# Altium schematic sheet ADCS.SchDoc
size A4; SheetNumber: 5; SheetTotal: 5
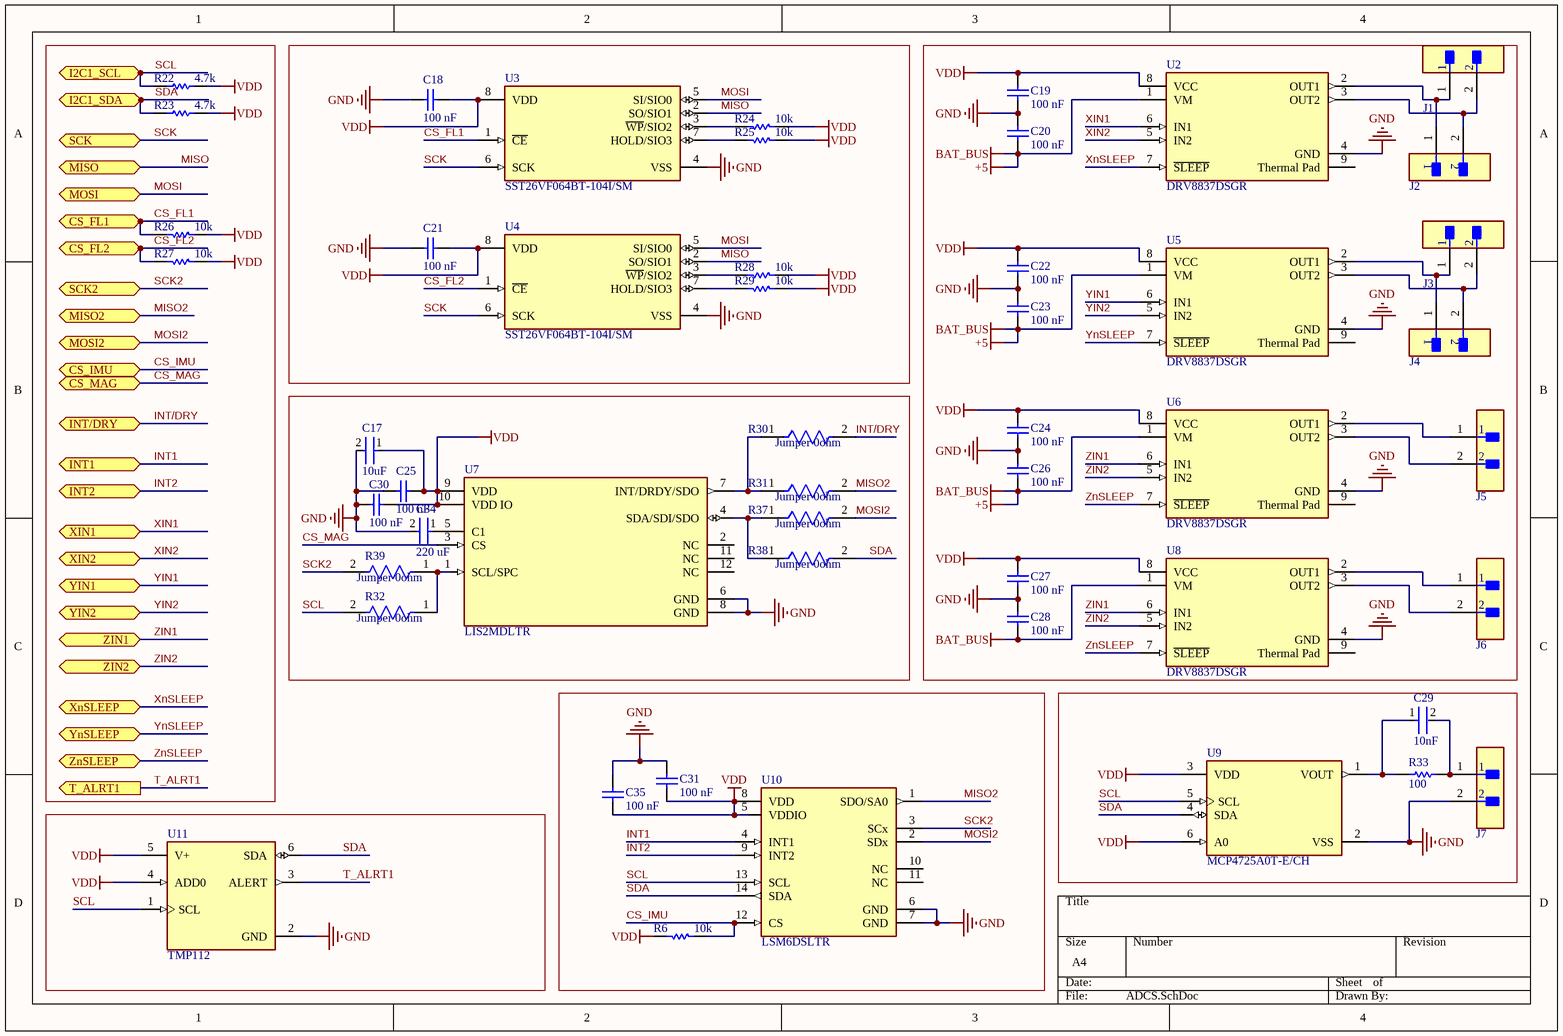
[diagram p0: ADCS.SchDoc]

## Parts
C17  10uF  [FP-CL21B106KOQNNNG-MFG]
C18  100 nF  [CAPC1050X55X23ML05T13]
C19  100 nF  [CAPC1050X55X23ML05T13]
C20  100 nF  [CAPC1050X55X23ML05T13]
C21  100 nF  [CAPC1050X55X23ML05T13]
C22  100 nF  [CAPC1050X55X23ML05T13]
C23  100 nF  [CAPC1050X55X23ML05T13]
C24  100 nF  [CAPC1050X55X23ML05T13]
C25  100 nF  [CAPC1050X55X23ML05T13]
C26  100 nF  [CAPC1050X55X23ML05T13]
C27  100 nF  [CAPC1050X55X23ML05T13]
C28  100 nF  [CAPC1050X55X23ML05T13]
C29  10nF  [FP-CL165-IPC_C]
C30  100 nF  [CAPC1050X55X23ML05T13]
C31  100 nF  [CAPC1050X55X23ML05T13]
C34  220 uF  [FP-C0603C-CF-MFG]
C35  100 nF  [CAPC1050X55X23ML05T13]
J1  B2B-XH-A(LF)(SN)  [FP-B2B-XH-A_LF_SN-MFG]  (value not drawn)
J2  B2B-XH-A(LF)(SN)  [FP-B2B-XH-A_LF_SN-MFG]  (value not drawn)
J3  B2B-XH-A(LF)(SN)  [FP-B2B-XH-A_LF_SN-MFG]  (value not drawn)
J4  B2B-XH-A(LF)(SN)  [FP-B2B-XH-A_LF_SN-MFG]  (value not drawn)
J5  B2B-XH-A(LF)(SN)  [FP-B2B-XH-A_LF_SN-MFG]  (value not drawn)
J6  B2B-XH-A(LF)(SN)  [FP-B2B-XH-A_LF_SN-MFG]  (value not drawn)
J7  B2B-XH-A(LF)(SN)  [FP-B2B-XH-A_LF_SN-MFG]  (value not drawn)
R6  10k  [RESC1005X40X25LL05T05]
R22  4.7k  [RESC1005X40X25LL05T05]
R23  4.7k  [RESC1005X40X25LL05T05]
R24  10k  [RESC1005X40X25LL05T05]
R25  10k  [RESC1005X40X25LL05T05]
R26  10k  [RESC1005X40X25LL05T05]
R27  10k  [RESC1005X40X25LL05T05]
R28  10k  [RESC1005X40X25LL05T05]
R29  10k  [RESC1005X40X25LL05T05]
R30  Jumper 0ohm  [FP-RC1206-MFG]
R31  Jumper 0ohm  [FP-RC1206-MFG]
R32  Jumper 0ohm  [FP-RC1206-MFG]
R33  100  [RESC1608X55X30LL15T15]
R37  Jumper 0ohm  [FP-RC1206-MFG]
R38  Jumper 0ohm  [FP-RC1206-MFG]
R39  Jumper 0ohm  [FP-RC1206-MFG]
U2  DRV8837DSGR  [FP-DSG0008A-MFG]
U3  SST26VF064BT-104I/SM  [FP-C04-056-IPC_A]
U4  SST26VF064BT-104I/SM  [FP-C04-056-IPC_A]
U5  DRV8837DSGR  [FP-DSG0008A-MFG]
U6  DRV8837DSGR  [FP-DSG0008A-MFG]
U7  LIS2MDLTR  [FP-LGA-12-DM00170568-MFG]
U8  DRV8837DSGR  [FP-DSG0008A-MFG]
U9  MCP4725A0T-E/CH  [FP-C04-028-CHY-IPC_A]
U10  LSM6DSLTR  [FP-LGA-14L-DM00249496-MFG]
U11  TMP112  [FP-DRL0006A-MFG]

## Ports
CS_FL1 (bidir, see Top[3B], MCU[2B]), CS_FL2 (bidir, see Top[3B], MCU[2B]), CS_IMU (bidir, see Top[3B], MCU[2B]), CS_MAG (bidir, see Top[3B], MCU[2B]), I2C1_SCL (bidir, see Top[3B], MCU[2B]), I2C1_SDA (bidir, see Top[3B], MCU[2B]), INT1 (bidir, see Top[3C], MCU[3A]), INT2 (bidir, see Top[3C], MCU[3A]), INT/DRY (bidir, see Top[3C], MCU[3A]), MISO2 (bidir, see Top[3B], MCU[2C]), MISO (bidir, see Top[3C], MCU[2A]), MOSI2 (bidir, see Top[3C], MCU[2C]), MOSI (bidir, see Top[3C], MCU[2A]), SCK2 (bidir, see Top[3B], MCU[2B]), SCK (bidir, see Top[3C], MCU[2A]), T_ALRT1 (out, see Top[3B], MCU[3A]), XIN1 (bidir, see Top[3C], MCU[3A]), XIN2 (bidir, see Top[3C], MCU[3A]), XnSLEEP (bidir, see Top[3C], MCU[2A]), YIN1 (bidir, see Top[3C], MCU[3A]), YIN2 (bidir, see Top[3C], MCU[3A]), YnSLEEP (bidir, see Top[3C], MCU[2A]), ZIN1 (bidir, see Top[3C], MCU[2A]), ZIN2 (bidir, see Top[3C], MCU[2A]), ZnSLEEP (bidir, see Top[3C], MCU[2B])

## Nets
+5: C20.1 C23.1 C26.1 C28.1 U2.1(VM) U5.1(VM) U6.1(VM) U8.1(VM)  [also labelled BAT_BUS]
GND: C17.2 C18.1 C19.2 C20.2 C21.1 C22.2 C23.2 C24.2 C25.1 C26.2 C27.2 C28.2 C30.1 C31.2 C34.2 C35.2 J7.2 U2.4(GND) U3.4(VSS) U4.4(VSS) U5.4(GND) U6.4(GND) U7.6(GND) U7.8(GND) U8.4(GND) U9.2(VSS) U10.6(GND) U10.7(GND) U11.2(GND)
VDD: C17.1 C18.2 C19.1 C21.2 C22.1 C24.1 C25.2 C27.1 C30.2 C31.1 C35.1 R6.2 R22.2 R23.2 R24.1 R25.1 R26.1 R27.1 R28.1 R29.1 U2.8(VCC) U3.8(VDD) U4.8(VDD) U5.8(VCC) U6.8(VCC) U7.9(VDD) U7.10(VDD_IO) U8.8(VCC) U9.3(VDD) U9.6(A0) U10.5(VDDIO) U10.8(VDD) U11.4(ADD0) U11.5(V+)
CS_FL1: R26.2 U3.1(~{CE}) ; port CS_FL1
CS_FL2: R27.2 U4.1(~{CE}) ; port CS_FL2
CS_IMU: R6.1 U10.12(CS) ; port CS_IMU
CS_MAG: U7.3(CS) ; port CS_MAG
INT1: U10.4(INT1) ; port INT1
INT2: U10.9(INT2) ; port INT2
INT/DRY: R30.2 ; port INT/DRY
MISO: U3.2(SO/SIO1) U4.2(SO/SIO1) ; port MISO
MISO2: R31.2 U10.1(SDO/SA0) ; port MISO2
MOSI: U3.5(SI/SIO0) U4.5(SI/SIO0) ; port MOSI
MOSI2: R37.2 U10.2(SDx) ; port MOSI2
SCK: U3.6(SCK) U4.6(SCK) ; port SCK
SCK2: R39.2 U10.3(SCx) ; port SCK2
SCL: R22.1 R32.2 U9.5(SCL) U10.13(SCL) U11.1(SCL) ; port I2C1_SCL
SDA: R23.1 R38.2 U9.4(SDA) U10.14(SDA) U11.6(SDA) ; port I2C1_SDA
T_ALRT1: U11.3(ALERT) ; port T_ALRT1
XIN1: U2.6(IN1) ; port XIN1
XIN2: U2.5(IN2) ; port XIN2
XnSLEEP: U2.7(~{SLEEP}) ; port XnSLEEP
YIN1: U5.6(IN1) ; port YIN1
YIN2: U5.5(IN2) ; port YIN2
YnSLEEP: U5.7(~{SLEEP}) ; port YnSLEEP
ZIN1: U6.6(IN1) U8.6(IN1) ; port ZIN1
ZIN2: U6.5(IN2) U8.5(IN2) ; port ZIN2
ZnSLEEP: U6.7(~{SLEEP}) U8.7(~{SLEEP}) ; port ZnSLEEP
NetC29_1: C29.1 R33.1 U9.1(VOUT)
NetC29_2: C29.2 J7.1 R33.2
NetC34_1: C34.1 U7.5(C1)
NetJ1_1: J1.1 J2.1 U2.2(OUT1)
NetJ1_2: J1.2 J2.2 U2.3(OUT2)
NetJ3_1: J3.1 J4.1 U5.2(OUT1)
NetJ3_2: J3.2 J4.2 U5.3(OUT2)
NetJ5_1: J5.1 U6.2(OUT1)
NetJ5_2: J5.2 U6.3(OUT2)
NetJ6_1: J6.1 U8.2(OUT1)
NetJ6_2: J6.2 U8.3(OUT2)
NetR24_2: R24.2 U3.3(~{WP}/SIO2)
NetR25_2: R25.2 U3.7(HOLD/SIO3)
NetR28_2: R28.2 U4.3(~{WP}/SIO2)
NetR29_2: R29.2 U4.7(HOLD/SIO3)
NetR30_1: R30.1 R31.1 U7.7(INT/DRDY/SDO)
NetR32_1: R32.1 R39.1 U7.1(SCL/SPC)
NetR37_1: R37.1 R38.1 U7.4(SDA/SDI/SDO)

Not connected (* = marked no-connect by the designer): U2 9(Thermal_Pad); U5 9(Thermal_Pad); U6 9(Thermal_Pad); U7 2(NC) 11(NC) 12(NC); U8 9(Thermal_Pad); U10 10(NC) 11(NC)

## Library data of the parts
C17 = CMP-13271-000015-1: CAP CER 10UF 16V X7R 0805; Manufacturer Part Number: CL21B106KOQNNNG; Manufacturer: Samsung Electro-Mechanics; Temperature Coefficient: 15%; Tolerance: 10%; Material: Ceramic; ComponentLink2URL: http://product.samsungsem.com/mlcc/CL21B106KOQNNN.do; Package: 0; Voltage Rating: 16V; Value: 10uF; Height: 1.4mm; Temperature Characteristic: X7R; Category: Cap; Lead Free: Yes; RoHS: TRUE; ComponentLink2Description: Datasheet; Octopart: https://octopart.com/cl21b106koqnnng-samsung-19995691; Device Class L1: Passive Components; Temperature Range Low: -55°C; Device Class L3: Ceramic Capacitors; Ipc Land Pattern Name: CAPC200125X125; Digikey Description: CAP CER 10UF 16V X7R 0805; Automotive: No; Capacitance: 10uF; Temperature Range High: +125°C; Device Class L2: Capacitors; Temperature: -55°C to +125°C
C18-C28 C30 C31 C35 = CMP-2000-05439-1: Chip Capacitor, 100 nF, +/- 10%, 16 V, -55 to 125 degC, 0402 (1005 Metric), RoHS, Tape and Reel; Manufacturer: Samsung Electro-Mechanics; Capacitance: 100000pF; Dielectric: X7R; Rated Voltage: 16V; Case Size/Dimension: 0402; Tolerance (%): ±10%; Manufacturer URL: http://www.samsungsem.com/global/index.jsp; Datasheet URL: https://datasheet.ciiva.com/29198/458718-da-01-en-vs-kondensator-0402-29198423.pdf; Datasheet Version: Nov-10
C29 = CMP-13271-000387-1: Cap Ceramic 10nF 50V X7R ±10% SMD 0402 +125°C Paper T/R; Depth: 0.5mm; Length: 1mm; Lead Free: Lead Free; Case Code (Metric): 1005; Width: 0.02inch; Min Operating Temperature: -55°C; Thickness: 0.022inch; Package Quantity: 1; Mount: Surface Mount; Height: 0.5mm; Voltage: 50V; Material: Ceramic; Tolerance: 10%; Case Code (Imperial): 0402; Radiation Hardening: No; Case/Package: 0402; Max Operating Temperature: 125°C; Voltage Rating (DC): 50V; Contact Plating: Tin; Packaging: Tape and Reel; Voltage Rating: 50V; Capacitance: 10nF; Dielectric: X7R
C34 = CMP-03020-018700-1: CAP CER 0603 .22UF 10V X7R 20% A; Manufacturer Part Number: C0603C224M8RACAUTO; Manufacturer: KEMET; Tolerance: 0.2; Automotive Grade: Grade 1; Value: 0.22 μF; Temperature Coefficient: 30ppm/°C; Material: Ceramic; Automotive: Yes; Temperature Characteristic: X7R; Height: 0.87mm; Digikey Description: CAP CER 0603 .22UF 10V X7R 20% A; Lead Free: Yes; Octopart: https://octopart.com/c0603c224m8racauto-kemet-75357852; Package: C0603C-CF; RoHS: TRUE; Category: Cap; Device Class L2: Capacitors; Voltage Rating: 10 V; Temperature Range High: +125°C; Device Class L3: Ceramic Capacitors; ComponentLink2URL: https://api.kemet.com/component-edge/download/datasheet/C0603C100J5GACAUTO.pdf; ComponentLink2Description: Datasheet; Temperature Range Low: -55°C; Capacitance: 0.22 μF; Device Class L1: Passive Components; Temperature: -55°C to +125°C
J1-J7 = CMP-2000-05888-3: CONN HEADER VERT 2POS 2.5MM; Current Rating: 3A; Voltage Rating: 250V; Number of Contacts: 2; Contact Resistance: 20mR; Wire/Cable Gauge: 22AWG; Insulation Resistance: 1GR; Connector Type: Male Pin; Packaging: Bulk; Contact Material: Brass; Lead Free: Lead Free; Orientation: Straight; Contact Plating: Tin; Max Current Rating: 3A; Termination: Solder; Fastening Type: Detent; Depth: 5.75mm; Housing Material: Polyamide; REACH SVHC: No SVHC; Series: XH; Voltage Rating (AC): 250V; Number of Positions: 2; Color: Natural; Contact Type: Male Pin; Max Voltage Rating (DC): 250V; Pitch: 2.5mm; Lead Pitch: 2.5mm; Mount: Through Hole; Max Operating Temperature: 85°C; Length: 7.4mm; Max Voltage Rating (AC): 250V; Min Operating Temperature: -25°C; Number of Rows: 1; Housing Color: White
R6 R24-R29 = CMP-2000-07588-1: Chip Resistor, 10 KOhm, +/- 1%, 0.1 W, -55 to 155 degC, 0402 (1005 Metric), RoHS, Tape and Reel; Manufacturer: Panasonic; Power Rating: 100mW; Voltage Rating: 50V; Resistance: 10KOhm; Case\/Package: 0402; Temperature Coefficient: 100ppm\/degreesC; RoHSCompliant: True; Lead Free: LeadFree; Package Quantity: 1; Contact Plating: Tin; Length: 1mm; Radiation Hardening: No; REACH SVHC: NoSVHC; Max Operating Temperature: 155degC; Depth: 0.5mm; Case Code (Imperial): 0402; Military Standard: Not; Package Description: 2-Pin Surface Mount Device, Body 1 x 0.5 mm; Termination: SMD/SMT; Case Code (Metric): 1005; Height: 0.35mm; Packaging: TapeandReel; Voltage Rating (DC): 50V; Package Reference: 402; Number of Pins: 2; Tolerance: 1%; Mounting Technology: SurfaceMount; Width: 0.02inch; Mount: SurfaceMount; Datasheet URL: https://industrial.panasonic.com/cdbs/www-data/pdf/RDA0000/AOA0000C304.pdf; Composition: ThickFilm; Datasheet Version: 02/2017; Manufacturer URL: http://www.panasonic.com/; Max Power Dissipation: 100mW; Number of Terminations: 2; Min Operating Temperature: -55degC
R22 R23 = CMP-2002-01154-4: Chip Resistor, 4.7 KOhm, +/- 1%, 0.1 W, -55 to 155 degC, 0402 (1005 Metric), RoHS, Tape and Reel; PartNumber: ERJ-2RKF4701X; Voltage Rating: 50 V; Case\/Package: 0402; Power Rating: 100 mW; Height: 0.35 mm; Mounting Technology: Surface Mount; REACH SVHC: Yes; Resistance: 4.7 KOhm; Max Operating Temperature: 155 degC; ComponentLink1Description: Manufacturer URL; ComponentLink2Description: Datasheet; Pins: 2; PackageReference: 0402; Tolerance: 1%; Case Code (Imperial): 0402; Length: 1 mm; PackageDescription: 2-Pin Surface Mount Device, Body 1 x 0.5 mm; RoHSCompliant: true; Package Quantity: 1; Radiation Hardening: No; DatasheetVersion: 04/2015; Width: 0.5 mm; Case Code (Metric): 1005; Mount: Surface Mount; ComponentLink1URL: http://www.panasonic.com/; Min Operating Temperature: -55 degC; Packaging: Cut Tape; ComponentLink2URL: http://industrial.panasonic.com/cdbs/www-data/pdf/RDA0000/AOA0000C86.pdf
R30-R32 R37-R39 = CMP-2100-03681-2: RES SMD 0 OHM JUMPER 1/4W 1206; Manufacturer Part Number: RC1206JR-070RL; Manufacturer: YAGEO; Voltage Rating: 200V; Temperature Coefficient: 300ppm/°C; Power Rating: 0.25W; Value: 0Ω; Tolerance: 5%; Temperature Range Low: -55°C; Category: Res; Automotive: No; Ipc Land Pattern Name: RESC310160X55; Device Class L1: Passive Components; Temperature: -55°C to +155°C; ComponentLink2URL: https://www.yageo.com/upload/media/product/productsearch/datasheet/rchip/PYu-RC_Group_51_RoHS_L_10.pdf; Lead Free: Yes; Height: 0.65mm; Footprint Url: https://www.yageo.com/upload/website/yageo_PYu-R_Mount_10_19050818_343.pdf; Package: RC1206; Digikey Description: RES SMD 0 OHM JUMPER 1/4W 1206; Temperature Range High: +155°C; Device Class L3: Chip SMD Resistors; Device Class L2: Resistors; Octopart: https://octopart.com/rc1206jr-070rl-yageo-40025601; Resistance: 0Ω; Series: RC; ComponentLink2Description: Datasheet; Composition: Thick Film; RoHS: TRUE; Mouser Description: Resistor: thick film; SMD; 1206; 0O; 0.25W; ±5%; -55÷155°C
R33 = CMP-2000-00179-1: Manufacturer: Panasonic; Part Number: ERJ-3EKF1000V
U2 U5 U6 U8 = CMP-04915-000004-1: IC MOTOR DRIVER PAR 8WSON; Manufacturer: Texas Instruments; Switching Frequency: 0-250kHz; Min Supply Voltage: 1.8V; Standoff Height: 0mm; Max Supply Voltage: 7V; Output Voltage: 0-11V; Motor Type: Brushed; Number Of Outputs: 2; Output Current: 1.8A; Max Junction Temp: +150°C; Nominal Supply Current: 300-700uA; Mouser Description: Motor / Motion / Ignition Controllers & Drivers 1.8A Low Vltg Brush DC Motor Driver; Device Class L2: Power Management ICs; Manufacturer Part Number: DRV8837DSGR; Temperature Range Low: -40°C; Lead Free: Yes; Height: 0.8mm; Device Class L3: Motor Drivers; Octopart: https://octopart.com/drv8837dsgr-texas+instruments-23786726; Package: DSG0008A; ComponentLink2URL: http://www.ti.com/lit/ds/symlink/drv8837.pdf; Temperature: -40°C to +85°C; Ambient Temperature Range Low: -40°C; ComponentLink2Description: Datasheet; Ambient Temperature Range High: +85°C; Device Class L1: Integrated Circuits (ICs); Category: IC; Temperature Range High: +85°C; RoHS: TRUE; Automotive: No; Digikey Description: IC MOTOR DRIVER PAR 8WSON
U3 U4 = CMP-06315-000009-1: IC FLASH 64M SPI 104MHZ 8SOIJ; Density: 64Mb; Page Size: 256B; Operating Supply Voltage: 3V; Interface: SPI; Frequency: 104MHz; Packaging: Tape and Reel; Max Operating Temperature: 85°C; Case/Package: SOIC; Number of Pins: 8; Min Operating Temperature: -40°C; Lead Free: Lead Free; Memory Type: FLASH
U7 = CMP-12173-000002-1: SENSOR MR I2C/SPI 12LGA; Manufacturer: STMicroelectronics; Sensing Method: Magnetic; Min Supply Voltage: 1.71V; Sensor Output: I2C,SPI; Operating Supply Current: 50-200uA; Max Supply Voltage: 3.6V; Octopart: https://octopart.com/lis2mdltr-stmicroelectronics-81117311; RoHS: TRUE; Device Class L3: unset; Device Class L1: Sensors; ComponentLink2URL: https://www.st.com/resource/en/datasheet/lis2mdl.pdf; Automotive: No; Device Class L2: Magnetic Sensors; Lead Free: Yes; Temperature: -40°C to +85°C; Manufacturer Part Number: LIS2MDLTR; Temperature Range High: +85°C; Height: 0.7mm; Digikey Description: SENSOR MR I2C/SPI 12LGA; Category: IC; ComponentLink2Description: Datasheet; Package: LGA-12-DM00170568; Temperature Range Low: -40°C
U9 = CMP-0188-00760-3: IC DAC 12BIT V-OUT SOT23-6; Number of Outputs: 1; Supply Type: Single; Integral Nonlinearity (INL): 14.5LSB; Polarity: Unipolar; Number of Bits: 12; Min Supply Voltage: 2.7V; Output Type: Voltage; Settling Time: 6us; Max Supply Voltage: 5.5V; Nominal Supply Current: 210uA; Resolution: 12b; Interface: I2C; Input Offset Voltage (Vos): 1.1mV; Radiation Hardening: No; Number of DAC Channels: 1; Length: 3.1mm; Number of D/A Converters: 1; Number of Pins: 6; Case/Package: SOT-23-6; Lead Free: Lead Free; Number of Channels: 1; Termination: SMD/SMT; Width: 1.8mm; Contact Plating: Tin; Package Quantity: 3000; Max Operating Temperature: 125°C; Min Operating Temperature: -40°C; REACH SVHC: No SVHC; Mount: Surface Mount; Height: 1.3mm; Packaging: Tape and Reel; Number of Converters: 1
U10 = CMP-2000-07467-2: IMU ACCEL/GYRO I2C/SPI 14LGA; Manufacturer: STMicroelectronics; Resolution: 16bits; Max Supply Voltage: 3.6V; Sensor Type: Temperature,Accelerometer,Gyroscope; Sensor Output: I2C,SPI; Gyro Range: 125/250/500/1000/2000°/s; Accel Range: 2/4/8/16g; Operating Supply Current: 0.29-0.65mA; Min Supply Voltage: 1.62V; Package: LGA-14L-DM00249496; Temperature Range High: +85°C; Automotive: No; Footprint Url: https://www.st.com/resource/en/technical_note/cd00134799.pdf; Height: 0.86mm; Device Class L1: Sensors; Octopart: https://octopart.com/lsm6dsltr-stmicroelectronics-66358193; Device Class L2: Motion Sensors; Lead Free: Yes; Category: IC; Device Class L3: Inertial Measurement Units (IMUs); ComponentLink2Description: Datasheet; RoHS: TRUE; ComponentLink2URL: https://www.st.com/resource/en/datasheet/lsm6dsl.pdf; Temperature Range Low: -40°C; Manufacturer Part Number: LSM6DSLTR; Mouser Description: iNEMO inertial module: always-on 3D accelerometer and 3D gyroscope; Digikey Description: IMU ACCEL/GYRO I2C/SPI 14LGA; Temperature: -40°C to +85°C
U11 = CMP-04948-000024-1: SENSOR DIGITAL -40C-125C 6SOT / TMP112AIDRLR, NOT AQDRLRQ1; Manufacturer: Texas Instruments; Manufacturer Part Number: TMP112AQDRLRQ1; Resolution: 12bits; Automotive Grade: Grade 1; Standoff Height: 0mm; Max Junction Temp: +150°C; Max Supply Voltage: 3.6V; Min Supply Voltage: 1.4V; Output Voltage: 5V; Interface: I2C,2-Wire,SMBus; Sensor Output: I2C,SMBus; Operating Supply Current: 7-85uA; Temperature Range Low: -40°C; Device Class L2: Temperature and Humidity Sensors; Height: 0.6mm; Automotive: Yes; Temperature Range High: +125°C; Category: IC; RoHS: TRUE; Lead Free: Yes; Ambient Temperature Range High: +125°C; Ambient Temperature Range Low: -40°C; Octopart: https://octopart.com/tmp112aqdrlrq1-texas+instruments-50418097; Ipc Land Pattern Name: SOTFL50P160X60-6; Device Class L1: Sensors; Device Class L3: unset; Digikey Description: SENSOR DIGITAL -40C-125C 6SOT; Mouser Description: Temp Sensor Digital Serial (2-Wire, I2C) Automotive 6-Pin SOT-563 T/R; Temperature: -40°C to +125°C; ComponentLink2Description: Datasheet; ComponentLink2URL: http://www.ti.com/lit/ds/symlink/tmp112-q1.pdf; Package: DRL0006A